# EAGLE design LD1-001 (EAGLE 7.1.0)
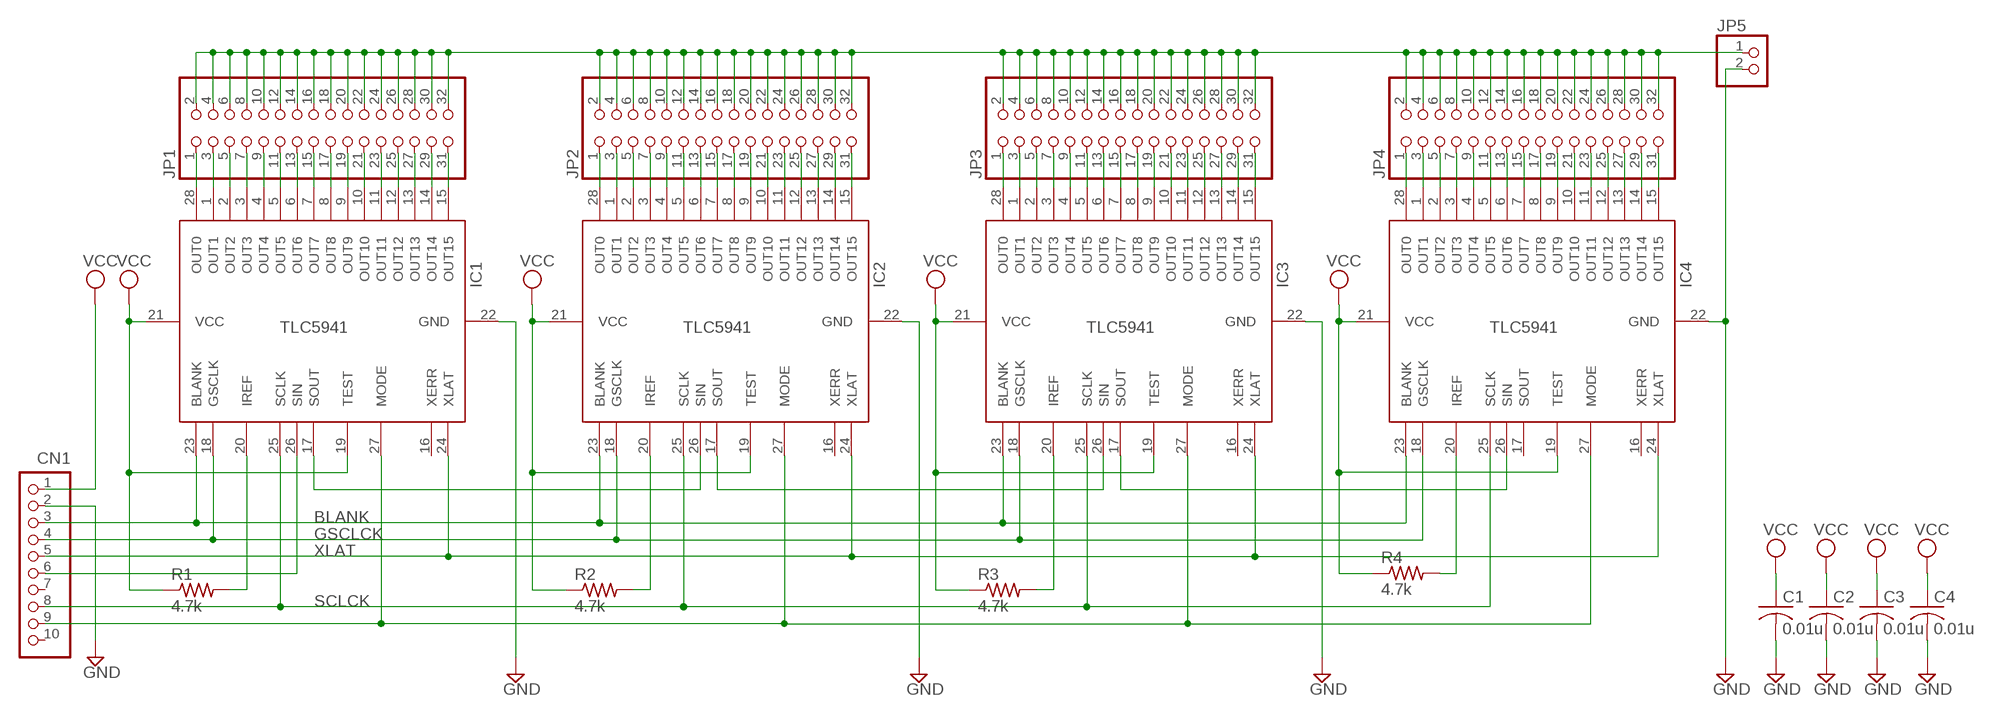
[diagram p0: schematic, sheet 1]

## Parts
C1  0.01u  C-US025-025X050  [C025-025X050]
C2  0.01u  C-US025-025X050  [C025-025X050]
C3  0.01u  C-US025-025X050  [C025-025X050]
C4  0.01u  C-US025-025X050  [C025-025X050]
CN1  S10B-PH-K-S  [S10B-PH-K-S]
IC1  TLC5941NT  [DIL28-3]
IC2  TLC5941NT  [DIL28-3]
IC3  TLC5941NT  [DIL28-3]
IC4  TLC5941NT  [DIL28-3]
JP1  PINHD-2X16  [2X16]
JP2  PINHD-2X16  [2X16]
JP3  PINHD-2X16  [2X16]
JP4  PINHD-2X16  [2X16]
JP5  PINHD-1X2  [1X02]
R1  4.7k  R-US_0204/5  [0204/5]
R2  4.7k  R-US_0204/5  [0204/5]
R3  4.7k  R-US_0204/5  [0204/5]
R4  4.7k  R-US_0204/5  [0204/5]

## Nets
BLANK: CN1.3 IC1.23(BLANK) IC2.23(BLANK) IC3.23(BLANK) IC4.23(BLANK)
GND: C1.2 C2.2 C3.2 C4.2 CN1.2 IC1.22(GND) IC2.22(GND) IC3.22(GND) IC4.22(GND) JP5.2
GSCLCK: CN1.4 IC1.18(GSCLK) IC2.18(GSCLK) IC3.18(GSCLK) IC4.18(GSCLK)
N$1: CN1.6 IC1.26(SIN)
N$2: IC1.17(SOUT) IC2.26(SIN)
N$3: IC2.17(SOUT) IC3.26(SIN)
N$4: IC3.17(SOUT) IC4.26(SIN)
N$5: IC1.28(OUT0) JP1.1
N$6: IC1.1(OUT1) JP1.3
N$7: IC1.2(OUT2) JP1.5
N$8: IC1.3(OUT3) JP1.7
N$9: IC1.4(OUT4) JP1.9
N$10: IC1.5(OUT5) JP1.11
N$11: IC1.6(OUT6) JP1.13
N$12: IC1.7(OUT7) JP1.15
N$13: IC1.8(OUT8) JP1.17
N$14: IC1.9(OUT9) JP1.19
N$15: IC1.10(OUT10) JP1.21
N$16: IC1.11(OUT11) JP1.23
N$17: IC1.12(OUT12) JP1.25
N$18: IC1.13(OUT13) JP1.27
N$19: IC1.14(OUT14) JP1.29
N$20: IC1.15(OUT15) JP1.31
N$21: IC2.28(OUT0) JP2.1
N$22: IC2.1(OUT1) JP2.3
N$23: IC2.2(OUT2) JP2.5
N$24: IC2.3(OUT3) JP2.7
N$25: IC2.4(OUT4) JP2.9
N$26: IC2.5(OUT5) JP2.11
N$27: IC2.6(OUT6) JP2.13
N$28: IC2.7(OUT7) JP2.15
N$29: IC2.8(OUT8) JP2.17
N$30: IC2.9(OUT9) JP2.19
N$31: IC2.10(OUT10) JP2.21
N$32: IC2.11(OUT11) JP2.23
N$33: IC2.12(OUT12) JP2.25
N$34: IC2.13(OUT13) JP2.27
N$35: IC2.14(OUT14) JP2.29
N$36: IC2.15(OUT15) JP2.31
N$37: IC4.20(IREF) R4.2
N$38: IC3.28(OUT0) JP3.1
N$39: IC3.1(OUT1) JP3.3
N$40: IC3.2(OUT2) JP3.5
N$41: IC3.3(OUT3) JP3.7
N$42: IC3.4(OUT4) JP3.9
N$43: IC3.5(OUT5) JP3.11
N$44: IC3.6(OUT6) JP3.13
N$45: IC3.7(OUT7) JP3.15
N$46: IC2.20(IREF) R2.2
N$47: IC3.20(IREF) R3.2
N$48: IC3.8(OUT8) JP3.17
N$49: IC3.9(OUT9) JP3.19
N$50: IC3.10(OUT10) JP3.21
N$51: IC3.11(OUT11) JP3.23
N$52: IC3.12(OUT12) JP3.25
N$53: IC3.13(OUT13) JP3.27
N$54: IC3.14(OUT14) JP3.29
N$55: IC3.15(OUT15) JP3.31
N$56: IC4.28(OUT0) JP4.1
N$57: IC4.1(OUT1) JP4.3
N$58: IC4.2(OUT2) JP4.5
N$59: IC4.3(OUT3) JP4.7
N$60: IC4.4(OUT4) JP4.9
N$61: IC4.5(OUT5) JP4.11
N$62: IC4.6(OUT6) JP4.13
N$63: IC4.7(OUT7) JP4.15
N$64: IC4.8(OUT8) JP4.17
N$65: IC1.20(IREF) R1.2
N$66: IC4.9(OUT9) JP4.19
N$67: IC4.10(OUT10) JP4.21
N$68: IC4.11(OUT11) JP4.23
N$69: IC4.12(OUT12) JP4.25
N$70: IC4.13(OUT13) JP4.27
N$71: IC4.14(OUT14) JP4.29
N$72: IC4.15(OUT15) JP4.31
N$73: JP1.2 JP1.4 JP1.6 JP1.8 JP1.10 JP1.12 JP1.14 JP1.16 JP1.18 JP1.20 JP1.22 JP1.24 JP1.26 JP1.28 JP1.30 JP1.32 JP2.2 JP2.4 JP2.6 JP2.8 JP2.10 JP2.12 JP2.14 JP2.16 JP2.18 JP2.20 JP2.22 JP2.24 JP2.26 JP2.28 JP2.30 JP2.32 JP3.2 JP3.4 JP3.6 JP3.8 JP3.10 JP3.12 JP3.14 JP3.16 JP3.18 JP3.20 JP3.22 JP3.24 JP3.26 JP3.28 JP3.30 JP3.32 JP4.2 JP4.4 JP4.6 JP4.8 JP4.10 JP4.12 JP4.14 JP4.16 JP4.18 JP4.20 JP4.22 JP4.24 JP4.26 JP4.28 JP4.30 JP4.32 JP5.1
N$75: CN1.9 IC1.27(MODE) IC2.27(MODE) IC3.27(MODE) IC4.27(MODE)
SCLCK: CN1.8 IC1.25(SCLK) IC2.25(SCLK) IC3.25(SCLK) IC4.25(SCLK)
VCC: C1.1 C2.1 C3.1 C4.1 CN1.1 IC1.19(TEST) IC1.21(VCC) IC2.19(TEST) IC2.21(VCC) IC3.19(TEST) IC3.21(VCC) IC4.19(TEST) IC4.21(VCC) R1.1 R2.1 R3.1 R4.1
XLAT: CN1.5 IC1.24(XLAT) IC2.24(XLAT) IC3.24(XLAT) IC4.24(XLAT)
Unconnected: CN1.7 CN1.10 IC1.16(XERR) IC2.16(XERR) IC3.16(XERR) IC4.16(XERR) IC4.17(SOUT)

## Library data of the parts
C1-C4 = rcl:C-US: CAPACITOR, American symbol
CN1 = jst-ph:S10B-PH-*: Wire-to-Board 2.0mm pitch side mount connector Source: http://www.jst-mfg.com/product/pdf/jpn/PH.pdf http://www.jst-mfg.com/product/detail.php?series=199
IC1-IC4 = adafruit:TLC5941
JP1-JP4 = pinhead:PINHD-2X16: PIN HEADER
JP5 = pinhead:PINHD-1X2: PIN HEADER
R1-R4 = resistor:R-US_: RESISTOR, American symbol

## Board
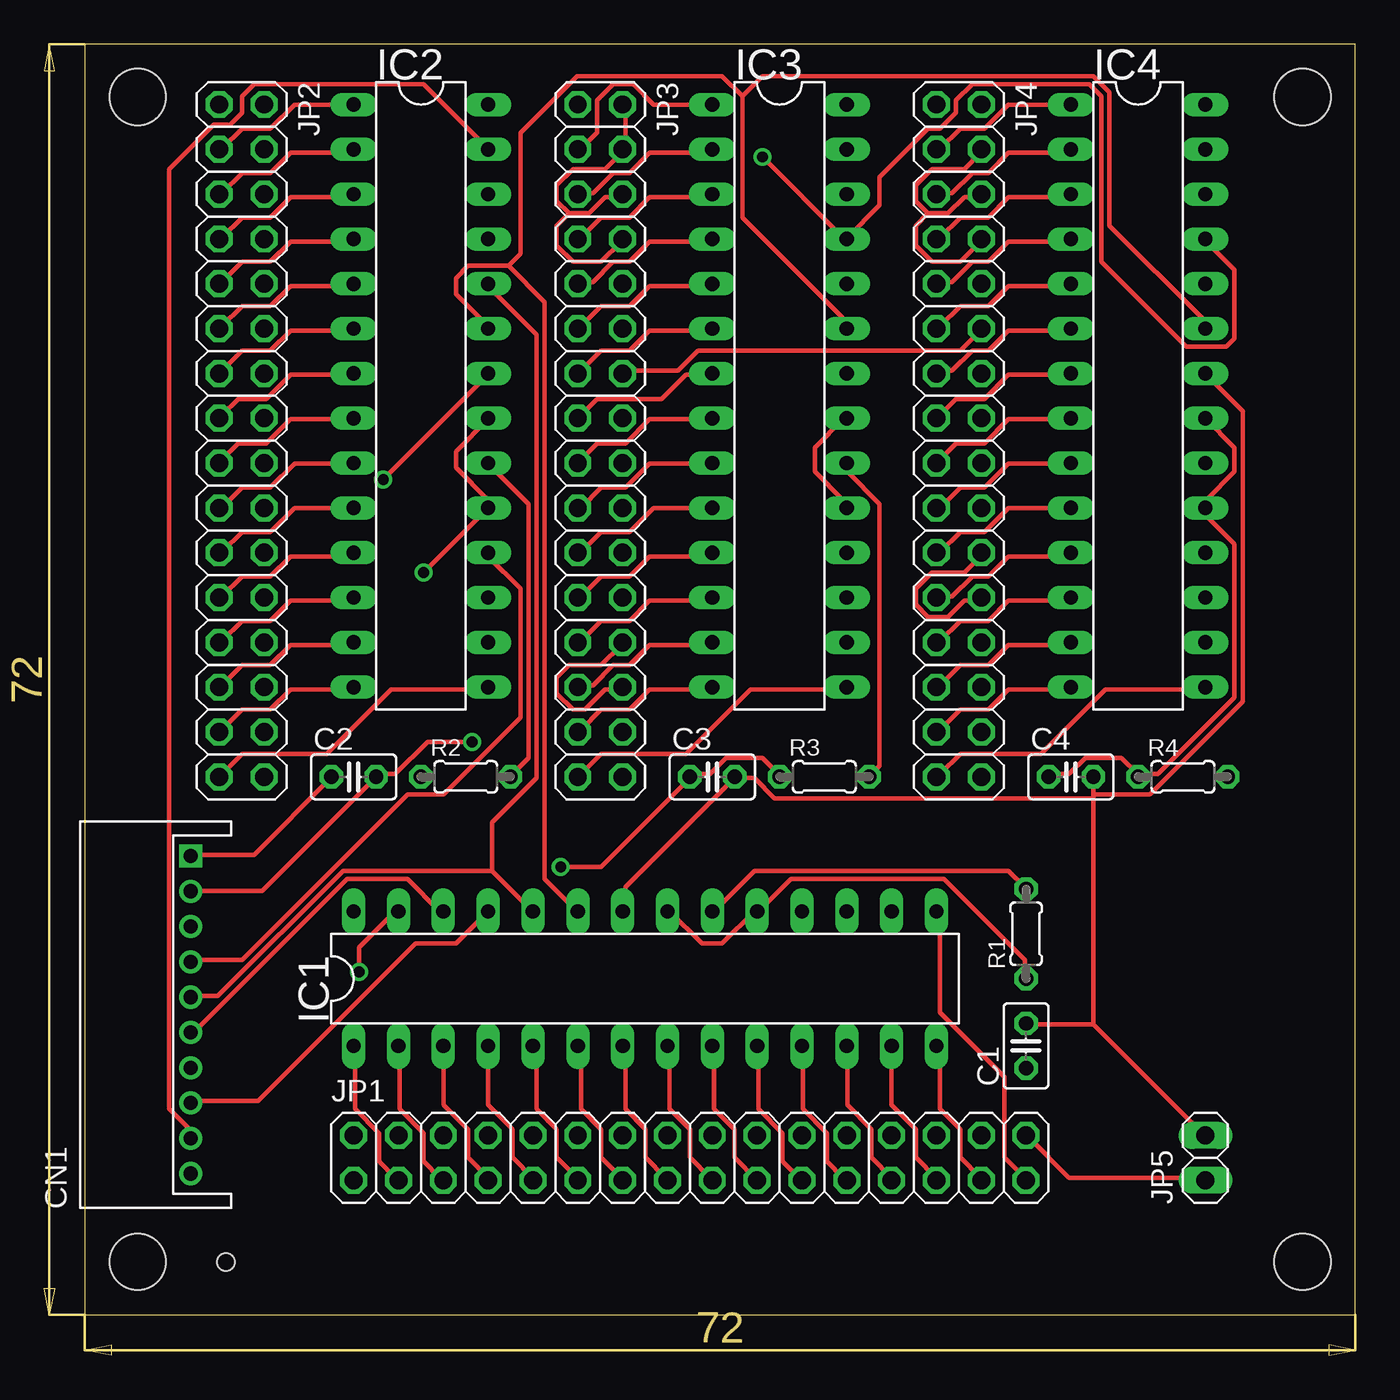
[diagram p1: board, top side]
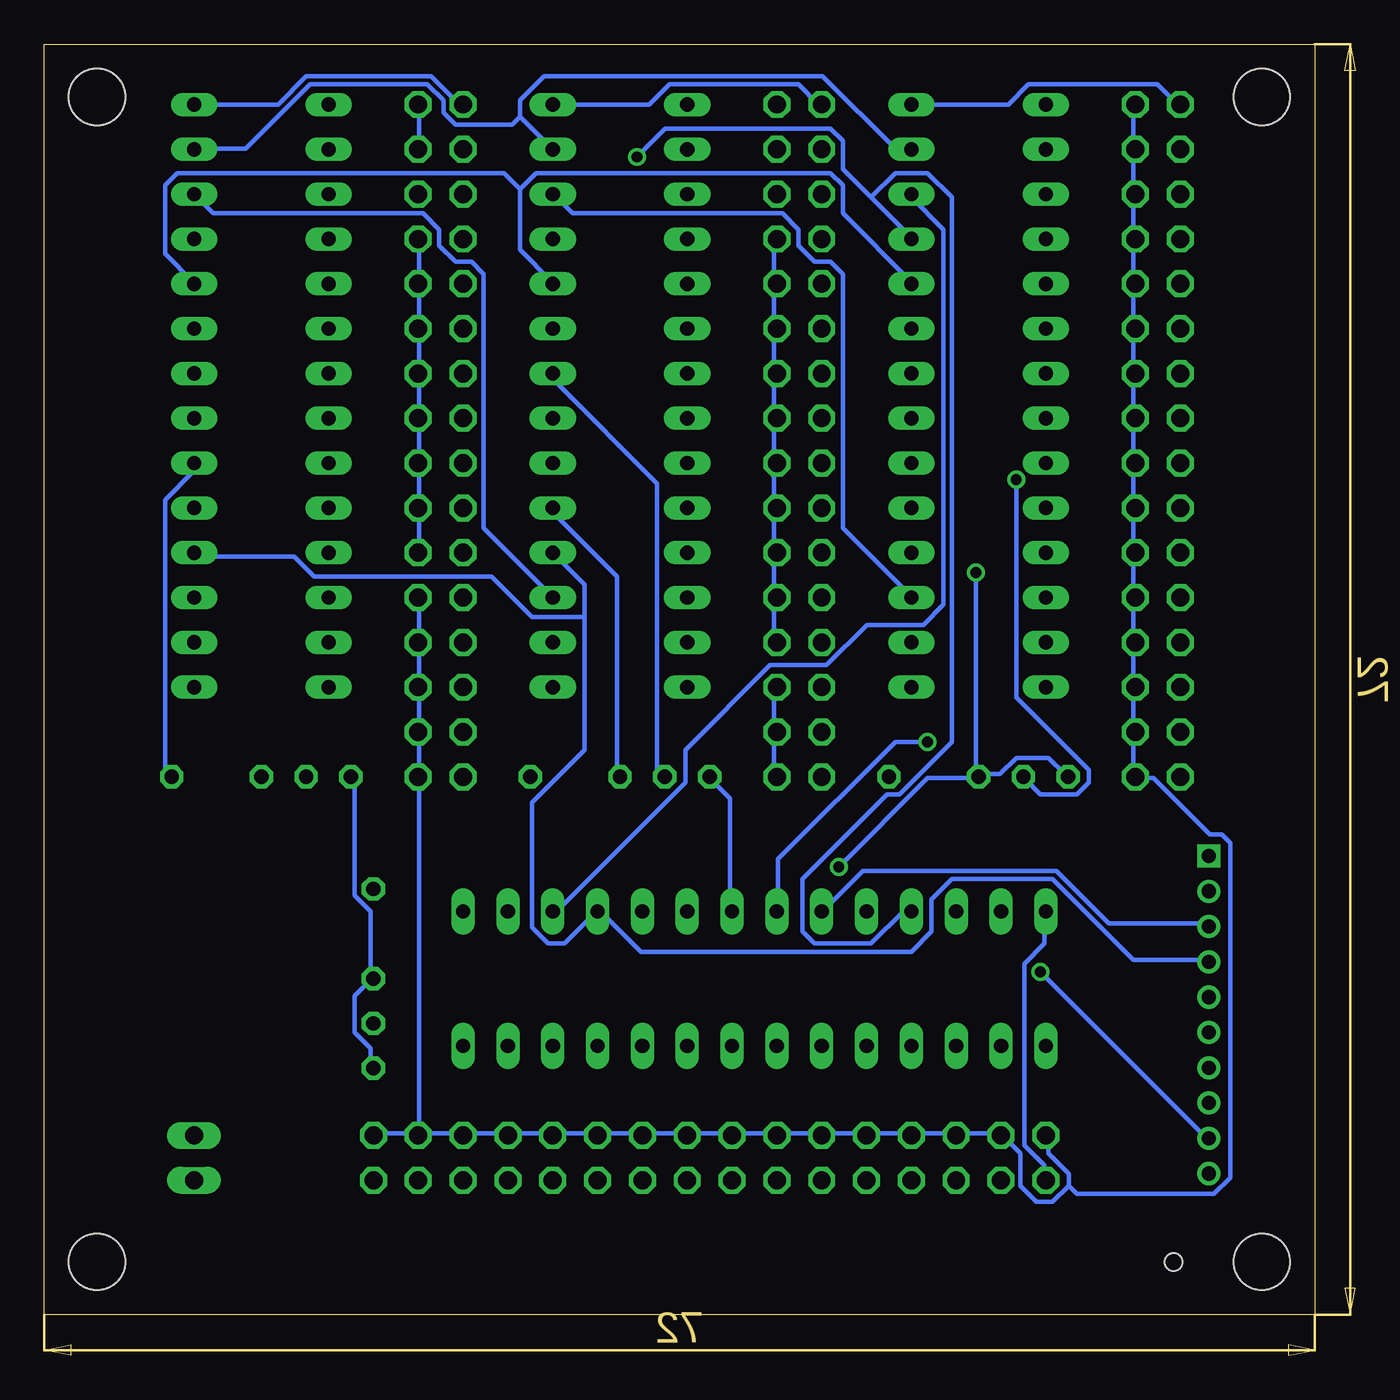
[diagram p2: board, bottom side, seen from below]

Size 72 x 72 mm. Coordinates in mm from the lower left corner, seen from the top.
Outline: 0,0 72,0 72,72 0,72 0,0
Copper layers (1*16): Top 0.035mm / dielectric 1.5mm / Bottom 0.035mm
Design rules "default": minimum track width 10mil, minimum drill 24mil, track to track 8mil, track to pad 8mil, pad to pad 8mil, via to via 8mil, smd to smd 8mil, copper to edge 40mil, drill to drill 8mil, minimum pad ring 10mil, minimum via ring 8mil, stop-mask expansion 4mil, vias tented up to drill 0mil, thermal gap 10mil
Holes 3.2 mm at 3,3 3,69 69,69 69,3
Holes 1 mm at 8,3

### Footprints (pad centres in the part's own frame; a part is rotated, then mirrored left to right if it is on the bottom)
C025-025X050 = drill 0.813 octagon: 1 -1.27,0; 2 1.27,0
S10B-PH-K-S = drill 0.8 square: 1 9,0 | drill 0.8: 2 7,0; 3 5,0; 4 3,0; 5 1,0; 6 -1,0; 7 -3,0; 8 -5,0; 9 -7,0; 10 -9,0
DIL28-3 = drill 0.813 long: 1 -16.51,-3.81; 2 -13.97,-3.81; 3 -11.43,-3.81; 4 -8.89,-3.81; 5 -6.35,-3.81; 6 -3.81,-3.81; 7 -1.27,-3.81; 8 1.27,-3.81; 9 3.81,-3.81; 10 6.35,-3.81; 11 8.89,-3.81; 12 11.43,-3.81; 13 13.97,-3.81; 14 16.51,-3.81; 15 16.51,3.81; 16 13.97,3.81; 17 11.43,3.81; 18 8.89,3.81; 19 6.35,3.81; 20 3.81,3.81; 21 1.27,3.81; 22 -1.27,3.81; 23 -3.81,3.81; 24 -6.35,3.81; 25 -8.89,3.81; 26 -11.43,3.81; 27 -13.97,3.81; 28 -16.51,3.81
2X16 = drill 1.016 octagon: 1 -19.05,-1.27; 2 -19.05,1.27; 3 -16.51,-1.27; 4 -16.51,1.27; 5 -13.97,-1.27; 6 -13.97,1.27; 7 -11.43,-1.27; 8 -11.43,1.27; 9 -8.89,-1.27; 10 -8.89,1.27; 11 -6.35,-1.27; 12 -6.35,1.27; 13 -3.81,-1.27; 14 -3.81,1.27; 15 -1.27,-1.27; 16 -1.27,1.27; 17 1.27,-1.27; 18 1.27,1.27; 19 3.81,-1.27; 20 3.81,1.27; 21 6.35,-1.27; 22 6.35,1.27; 23 8.89,-1.27; 24 8.89,1.27; 25 11.43,-1.27; 26 11.43,1.27; 27 13.97,-1.27; 28 13.97,1.27; 29 16.51,-1.27; 30 16.51,1.27; 31 19.05,-1.27; 32 19.05,1.27
1X02 = drill 1.016 long: 1 -1.27,0; 2 1.27,0
0204/5 = drill 0.813 octagon: 1 -2.54,0; 2 2.54,0

### Placement (x,y rotation side)
C1  53.34,15.24 90 top
C2  15.24,30.48 0 top
C3  35.56,30.48 0 top
C4  55.88,30.48 0 top
CN1  6,17 90 top
IC1  31.75,19.05 0 top
IC2  19.05,52.07 270 top
IC3  39.37,52.07 270 top
IC4  59.69,52.07 270 top
JP1  34.29,8.89 0 top
JP2  8.89,49.53 270 top
JP3  29.21,49.53 270 top
JP4  49.53,49.53 270 top
JP5  63.5,8.89 90 top
R1  53.34,21.59 90 top
R2  21.59,30.48 0 top
R3  41.91,30.48 0 top
R4  62.23,30.48 0 top

### Tracks (layer width: path | path; a pad name or v marks a point on that pad's centre or on a via)
BLANK
  Top 0.254: 24,59.44 21.72,59.44 21.03,58.75 21.03,57.84 22.86,56.01 IC2.23 | 24,59.44 26.06,57.38 26.06,24.69 27.89,22.86 IC1.23 | 37.26,69.04 37.26,62.18 42.98,56.46 42.98,56.01 IC3.23 | 37.26,69.04 36.12,70.18 27.89,70.18 24.69,66.98 24.69,60.12 24,59.44 | 37.26,69.04 38.41,70.18 57.15,70.18 58.06,69.27 58.06,61.72 63.32,56.46 63.32,56.01 IC4.23
  Bottom 0.254: CN1.3 6.17,22.17 11.66,22.17 14.63,25.15 25.6,25.15 27.89,22.86 IC1.23
GND  (via drill 0.61)
  Top 0.254: CN1.2 6.17,24 10.06,24 16.46,30.4 C2.2 16.69,30.63 17.6,30.63 19.43,32.46 v21.95,32.46 | v16.92,47.32 22.86,53.26 IC2.22 | IC1.22 30.63,22.86 30.63,24.23 36.8,30.4 C3.2 37.03,30.4 37.95,30.4 39.09,29.26 57.15,29.26 | 57.15,16.46 53.49,16.46 C1.2 | 57.15,16.46 63.32,10.29 JP5.2 | 57.15,16.46 57.15,29.26 | 57.15,29.26 57.15,29.49 | 57.15,29.49 C4.2 | 57.15,29.49 60.35,29.49 65.61,34.75 65.61,51.21 63.55,53.26 IC4.22
  Bottom 0.254: v16.92,47.32 16.92,34.98 12.8,30.86 12.8,30.18 13.49,29.49 15.54,29.49 16.46,30.4 C2.2 | IC3.22 42.98,53.26 42.98,52.81 37.26,47.09 37.26,30.86 37.03,30.63 C3.2 | v21.95,32.46 23.77,32.46 30.4,25.83 30.4,22.86 IC1.22
GSCLCK
  Top 0.254: CN1.4 6.17,20.12 8.91,20.12 18.29,29.49 20.34,29.49 24.69,33.83 24.69,41.15 22.86,42.98 IC2.18
  Bottom 0.254: 41.38,39.55 41.38,41.38 IC3.18 | 41.38,39.55 41.38,32 44.35,29.03 44.35,21.95 43.43,21.03 42.52,21.03 40.69,22.86 IC1.18 40.46,22.86 38.18,20.57 22.86,20.57 21.72,21.72 21.72,23.55 20.57,24.69 14.86,24.69 10.29,20.12 6.17,20.12 CN1.4 | 41.38,39.55 44.35,39.55 46.63,41.83 56.69,41.83 57.84,42.98 63.32,42.98 IC4.18
N$1
  Top 0.254: CN1.6 6.17,16 14.86,24.69 18.29,24.69 20.12,22.86 IC1.26
N$2
  Bottom 0.254: IC2.26 22.86,63.32 21.03,61.49 21.03,40.23 22.17,39.09 25.38,39.09 27.66,36.8 30.86,36.8 35.66,32 35.66,30.18 42.98,22.86 IC1.17
N$3
  Bottom 0.254: IC2.17 22.86,40.69 26.75,44.58 26.75,58.98 27.43,59.66 28.35,59.66 29.26,60.58 29.26,61.49 30.18,62.41 42.06,62.41 42.98,63.32 IC3.26
N$4
  Bottom 0.254: IC4.26 62.41,62.41 50.52,62.41 49.61,61.49 49.61,60.58 48.69,59.66 47.78,59.66 47.09,58.98 47.09,44.58 43.2,40.69 IC3.17
N$5
  Bottom 0.254: IC1.28 15.32,22.86 15.32,21.03 16.46,19.89 16.46,9.6 15.32,8.46 15.32,7.77 JP1.1
N$6
  Top 0.254: IC1.1 15.32,15.09 15.32,11.66 16.69,10.29 16.69,8.69 17.6,7.77 JP1.3
N$7
  Top 0.254: IC1.2 17.83,15.09 17.83,11.66 19.2,10.29 19.2,8.69 20.12,7.77 JP1.5
N$8
  Top 0.254: IC1.3 20.34,15.09 20.34,11.89 21.72,10.52 21.72,8.91 22.86,7.77 JP1.7
N$9
  Top 0.254: IC1.4 22.86,11.89 24.23,10.52 24.23,8.91 25.38,7.77 JP1.9
N$10
  Top 0.254: IC1.5 25.6,15.09 25.6,11.66 26.75,10.52 26.75,8.91 27.89,7.77 JP1.11
N$11
  Top 0.254: IC1.6 28.12,15.09 28.12,11.66 29.26,10.52 29.26,8.91 30.4,7.77 JP1.13
N$12
  Top 0.254: IC1.7 30.63,15.09 30.63,11.66 31.77,10.52 31.77,8.91 32.92,7.77 JP1.15
N$13
  Top 0.254: IC1.8 33.15,15.09 33.15,11.66 34.29,10.52 34.29,8.91 35.43,7.77 JP1.17
N$14
  Top 0.254: JP1.19 36.8,8.91 36.8,10.52 35.66,11.66 35.66,15.09 IC1.9
N$15
  Top 0.254: IC1.10 38.18,15.09 38.18,11.66 39.55,10.29 39.55,8.69 40.46,7.77 JP1.21
N$16
  Top 0.254: IC1.11 40.69,15.09 40.69,11.66 42.06,10.29 42.06,8.69 42.98,7.77 JP1.23
N$17
  Top 0.254: IC1.12 43.2,15.09 43.2,11.89 44.58,10.52 44.58,8.91 45.72,7.77 JP1.25
N$18
  Top 0.254: IC1.13 45.72,11.89 47.09,10.52 47.09,8.91 48.23,7.77 JP1.27
N$19
  Top 0.254: IC1.14 48.46,15.09 48.46,11.66 49.61,10.52 49.61,8.91 50.75,7.77 JP1.29
N$20
  Top 0.254: IC1.15 48.46,22.86 48.46,17.14 52.12,13.49 52.12,8.91 53.26,7.77 JP1.31
N$21
  Bottom 0.254: IC2.28 17.37,68.58 16.23,69.72 8.91,69.72 7.77,68.58 JP2.1
N$22
  Top 0.254: IC2.1 11.89,68.58 10.52,67.21 8.91,67.21 7.77,66.06 JP2.3
N$23
  Top 0.254: IC2.2 15.09,65.84 11.66,65.84 10.52,64.69 8.91,64.69 7.77,63.55 JP2.5
N$24
  Top 0.254: IC2.3 15.09,63.32 11.66,63.32 10.52,62.18 8.91,62.18 7.77,61.04 JP2.7
N$25
  Top 0.254: IC2.4 15.09,60.81 11.66,60.81 10.52,59.66 8.91,59.66 7.77,58.52 JP2.9
N$26
  Top 0.254: IC2.5 15.09,58.29 11.66,58.29 10.52,57.15 8.91,57.15 7.77,56.01 JP2.11
N$27
  Top 0.254: JP2.13 8.91,54.63 10.52,54.63 11.66,55.78 15.09,55.78 IC2.6
N$28
  Top 0.254: IC2.7 15.09,53.26 11.66,53.26 10.29,51.89 8.69,51.89 7.77,50.98 JP2.15
N$29
  Top 0.254: IC2.8 15.09,50.75 11.66,50.75 10.29,49.38 8.69,49.38 7.77,48.46 JP2.17
N$30
  Top 0.254: IC2.9 15.09,48.23 11.89,48.23 10.52,46.86 8.91,46.86 7.77,45.72 JP2.19
N$31
  Top 0.254: IC2.10 11.89,45.72 10.52,44.35 8.91,44.35 7.77,43.2 JP2.21
N$32
  Top 0.254: IC2.11 15.09,42.98 11.66,42.98 10.52,41.83 8.91,41.83 7.77,40.69 JP2.23
N$33
  Top 0.254: IC2.12 15.09,40.46 11.66,40.46 10.52,39.32 8.91,39.32 7.77,38.18 JP2.25
N$34
  Top 0.254: IC2.13 15.09,37.95 11.66,37.95 10.52,36.8 8.91,36.8 7.77,35.66 JP2.27
N$35
  Top 0.254: IC2.14 15.09,35.43 11.66,35.43 10.52,34.29 8.91,34.29 7.77,33.15 JP2.29
N$36
  Top 0.254: JP2.31 8.91,31.77 13.72,31.77 17.37,35.43 22.86,35.43 IC2.15
N$37
  Bottom 0.254: R4.2 65.15,30.86 65.15,46.18 63.55,47.78 63.55,48.23 IC4.20
N$38
  Bottom 0.254: IC3.28 37.72,68.58 36.58,69.72 29.26,69.72 28.12,68.58 JP3.1
N$39
  Top 0.254: IC3.1 32.23,68.58 31.09,69.72 29.95,69.72 29.03,68.81 29.03,66.98 28.12,66.06 JP3.3
N$40
  Top 0.254: IC3.2 35.43,65.84 32,65.84 30.86,64.69 29.95,64.69 28.8,63.55 28.12,63.55 JP3.5
N$41
  Top 0.254: IC3.3 35.43,63.32 32,63.32 30.86,62.18 29.26,62.18 28.12,61.04 JP3.7
N$42
  Top 0.254: IC3.4 35.43,60.81 32,60.81 30.86,59.66 29.95,59.66 28.8,58.52 28.12,58.52 JP3.9
N$43
  Top 0.254: IC3.5 35.43,58.29 32,58.29 30.86,57.15 29.26,57.15 28.12,56.01 JP3.11
N$44
  Top 0.254: IC3.6 35.43,55.78 32,55.78 30.86,54.63 29.26,54.63 28.12,53.49 JP3.13
N$45
  Top 0.254: JP3.15 29.03,51.89 32.69,51.89 34.06,53.26 35.43,53.26 IC3.7
N$46
  Top 0.254: IC2.20 22.86,48.23 25.15,45.95 25.15,31.55 24.23,30.63 R2.2
N$47
  Top 0.254: IC3.20 43.2,48.23 43.2,47.78 45.03,45.95 45.03,31.09 44.58,30.63 R3.2
N$48
  Top 0.254: IC3.8 35.43,50.75 32,50.75 30.63,49.38 29.03,49.38 28.12,48.46 JP3.17
N$49
  Top 0.254: IC3.9 35.43,48.23 32,48.23 30.63,46.86 29.26,46.86 28.12,45.72 JP3.19
N$50
  Top 0.254: IC3.10 32.23,45.72 30.86,44.35 29.26,44.35 28.12,43.2 JP3.21
N$51
  Top 0.254: IC3.11 35.43,42.98 32,42.98 30.86,41.83 29.26,41.83 28.12,40.69 JP3.23
N$52
  Top 0.254: IC3.12 35.43,40.46 32,40.46 30.86,39.32 29.26,39.32 28.12,38.18 JP3.25
N$53
  Top 0.254: IC3.13 35.43,37.95 32,37.95 30.86,36.8 29.95,36.8 28.8,35.66 28.12,35.66 JP3.27
N$54
  Top 0.254: IC3.14 35.43,35.43 32,35.43 30.86,34.29 29.26,34.29 28.12,33.15 JP3.29
N$55
  Top 0.254: IC3.15 42.98,35.43 37.72,35.43 34.06,31.77 29.26,31.77 28.12,30.63 JP3.31
N$56
  Bottom 0.254: IC4.28 58.75,68.58 57.15,70.18 50.06,70.18 48.46,68.58 JP4.1
N$57
  Top 0.254: IC4.1 52.35,68.58 50.98,67.21 49.61,67.21 48.46,66.06 JP4.3
N$58
  Top 0.254: IC4.2 55.78,65.84 52.35,65.84 51.21,64.69 50.29,64.69 49.15,63.55 48.46,63.55 JP4.5
N$59
  Top 0.254: IC4.3 55.78,63.32 52.35,63.32 51.21,62.18 49.61,62.18 48.46,61.04 JP4.7
N$60
  Top 0.254: IC4.4 55.78,60.81 52.35,60.81 51.21,59.66 50.29,59.66 49.15,58.52 48.46,58.52 JP4.9
N$61
  Top 0.254: IC4.5 55.78,58.29 52.35,58.29 51.21,57.15 49.61,57.15 48.46,56.01 JP4.11
N$62
  Top 0.254: IC4.6 55.78,55.78 52.35,55.78 51.21,54.63 50.29,54.63 49.15,53.49 48.46,53.49 JP4.13
N$63
  Top 0.254: IC4.7 55.78,53.26 52.35,53.26 50.98,51.89 49.38,51.89 48.46,50.98 JP4.15
N$64
  Top 0.254: JP4.17 49.38,49.38 50.98,49.38 52.35,50.75 55.78,50.75 IC4.8
N$65
  Top 0.254: IC1.20 35.66,22.86 37.95,25.15 52.35,25.15 53.26,24.23 R1.2
N$66
  Top 0.254: IC4.9 55.78,48.23 52.35,48.23 50.98,46.86 49.61,46.86 48.46,45.72 JP4.19
N$67
  Top 0.254: IC4.10 52.35,45.72 50.98,44.35 49.61,44.35 48.46,43.2 JP4.21
N$68
  Top 0.254: IC4.11 55.78,42.98 52.35,42.98 51.21,41.83 50.29,41.83 49.15,40.69 48.46,40.69 JP4.23
N$69
  Top 0.254: IC4.12 55.78,40.46 52.35,40.46 51.21,39.32 49.61,39.32 48.46,38.18 JP4.25
N$70
  Top 0.254: IC4.13 55.78,37.95 52.35,37.95 51.21,36.8 49.61,36.8 48.46,35.66 JP4.27
N$71
  Top 0.254: IC4.14 55.78,35.43 52.35,35.43 51.21,34.29 49.61,34.29 48.46,33.15 JP4.29
N$72
  Top 0.254: IC4.15 63.32,35.43 57.84,35.43 54.18,31.77 49.61,31.77 48.46,30.63 JP4.31
N$73
  Top 0.254: JP3.28 30.4,35.43 29.49,35.43 28.35,34.29 27.66,34.29 26.75,35.2 26.75,36.12 27.43,36.8 29.26,36.8 30.4,37.95 JP3.26 | 27.43,62.41 28.57,62.41 29.49,63.32 30.4,63.32 JP3.6 | 27.43,62.41 26.75,63.09 26.75,64.01 27.66,64.92 29.49,64.92 30.4,65.84 JP3.4 30.63,66.06 30.63,68.58 JP3.2 | 27.43,62.41 26.75,61.72 26.75,60.58 27.66,59.66 29.26,59.66 30.4,60.81 JP3.8 | 47.78,62.41 48.92,62.41 49.84,63.32 50.75,63.32 JP4.6 | 47.78,62.41 47.09,63.09 47.09,64.01 48.01,64.92 49.84,64.92 50.75,65.84 JP4.4 | 47.78,62.41 47.09,61.72 47.09,60.58 48.01,59.66 49.61,59.66 50.75,60.81 JP4.8 | JP4.24 50.75,40.46 49.84,40.46 48.92,39.55 47.78,39.55 47.09,40.23 47.09,41.15 48.01,42.06 49.84,42.06 50.75,42.98 JP4.22 | JP5.1 63.32,7.77 55.78,7.77 53.49,10.06 JP1.32 | JP3.14 30.63,53.49 33.6,53.49 34.75,54.63 49.61,54.63 50.75,55.78 JP4.12
  Bottom 0.254: JP3.32 30.63,30.63 30.63,32.92 JP3.30 30.63,33.15 30.63,35.43 JP3.28 | JP3.26 30.63,38.18 30.63,40.46 JP3.24 30.63,40.69 30.63,42.98 JP3.22 30.63,43.2 30.63,45.72 | JP3.8 30.63,60.81 30.63,58.52 JP3.10 30.63,58.29 30.63,56.01 JP3.12 30.63,55.78 30.63,53.49 JP3.14 30.63,53.26 30.63,50.98 JP3.16 30.63,50.75 30.63,48.46 JP3.18 30.63,48.23 30.63,45.72 | 30.63,45.72 JP3.20 | JP4.24 50.75,40.46 50.75,38.18 JP4.26 50.75,37.95 50.75,35.66 JP4.28 50.75,35.43 50.75,33.15 JP4.30 50.75,32.92 50.75,30.63 JP4.32 50.75,30.4 50.75,10.29 | JP4.2 50.75,68.58 50.75,66.06 JP4.4 | JP4.8 50.75,60.81 50.75,58.52 JP4.10 50.75,58.29 50.75,56.01 JP4.12 50.75,55.78 50.75,53.49 JP4.14 50.75,53.26 50.75,50.98 JP4.16 50.75,50.75 50.75,48.46 JP4.18 50.75,48.23 50.75,45.72 | 50.75,45.72 50.75,43.2 JP4.22 | 50.75,45.72 JP4.20 | JP2.2 10.29,68.58 10.29,66.06 JP2.4 10.29,65.84 10.29,63.55 JP2.6 10.29,63.32 10.29,61.04 JP2.8 10.29,60.81 10.29,58.52 JP2.10 10.29,58.29 10.29,56.01 JP2.12 10.29,55.78 10.29,53.49 JP2.14 10.29,53.26 10.29,50.98 JP2.16 10.29,50.75 10.29,48.46 JP2.18 10.29,48.23 10.29,45.72 | 10.29,45.72 10.29,43.2 JP2.22 10.29,42.98 10.29,40.69 JP2.24 10.29,40.46 10.29,38.18 JP2.26 10.29,37.95 10.29,35.66 JP2.28 10.29,35.43 10.29,33.15 JP2.30 10.29,32.92 10.29,30.63 JP2.32 10.06,30.4 9.14,30.4 5.94,27.2 5.26,27.2 4.8,26.75 4.8,7.77 5.71,6.86 13.49,6.86 13.95,7.32 | 10.29,45.72 JP2.20 | 50.75,10.29 48.46,10.29 JP1.28 48.23,10.29 45.72,10.29 | JP1.32 53.26,10.29 50.98,10.29 JP1.30 50.75,10.29 | 13.95,7.32 13.95,8 15.09,9.14 15.09,10.06 JP1.2 | 13.95,7.32 14.86,6.4 15.77,6.4 16.69,7.32 16.69,9.14 17.6,10.06 JP1.4 17.83,10.29 20.12,10.29 JP1.6 20.34,10.29 22.86,10.29
  Bottom 0.254: 45.72,10.29 43.2,10.29 JP1.24 42.98,10.29 40.69,10.29 JP1.22 40.46,10.29 38.18,10.29 JP1.20 37.95,10.29 35.66,10.29 JP1.18 35.43,10.29 33.15,10.29 JP1.16 32.92,10.29 30.63,10.29 JP1.14 30.4,10.29 28.12,10.29 JP1.12 27.89,10.29 25.6,10.29 JP1.10 25.38,10.29 22.86,10.29 | 22.86,10.29 JP1.8 | 45.72,10.29 JP1.26
N$75  (via drill 0.61)
  Top 0.254: v15.54,19.43 15.54,20.8 17.6,22.86 IC1.27 | CN1.9 5.94,10.06 5.94,10.52 4.8,11.66 4.8,64.92 7.32,67.44 8.23,67.44 8.91,68.12 8.91,69.04 9.6,69.72 19.2,69.72 22.86,66.06 IC2.27
  Bottom 0.254: v15.54,19.43 6.17,10.06 CN1.9 | 45.03,67.89 45.03,68.81 43.66,70.18 27.89,70.18 23.77,66.06 22.86,66.06 IC2.27 | IC3.27 45.03,67.89 | 45.03,67.89 45.49,67.44 48.69,67.44 49.38,68.12 49.38,68.81 50.29,69.72 56.92,69.72 60.58,66.06 63.32,66.06 IC4.27
SCLCK  (via drill 0.61)
  Top 0.254: IC1.25 21.03,21.03 18.75,21.03 9.83,12.12 6.17,12.12 CN1.8 | v38.41,65.61 42.98,61.04 IC3.25 43.2,61.04 45.03,62.87 45.03,64.47 47.78,67.21 48.46,67.21 49.38,68.12 49.38,68.81 50.29,69.72 56.92,69.72 57.61,69.04 57.61,59.66 62.41,54.86 64.69,54.86 65.15,55.32 65.15,59.21 63.55,60.81 IC4.25
  Bottom 0.254: 25.15,63.32 26.75,64.92 26.75,66.52 27.43,67.21 36.8,67.21 v38.41,65.61 | 25.15,63.32 22.86,61.04 IC2.25 | IC1.25 23.32,22.86 25.15,21.03 28.35,21.03 29.03,21.72 29.03,24.69 24.23,29.49 23.55,29.49 20.57,32.46 20.57,63.32 21.95,64.69 23.77,64.69 25.15,63.32
VCC  (via drill 0.61)
  Top 0.254: IC2.21 22.86,50.75 21.03,48.92 21.03,48.01 22.86,46.18 IC2.19 v19.2,42.06 | CN1.1 6.17,26.06 9.6,26.06 13.95,30.4 C2.1 | IC3.19 42.98,45.72 42.98,46.18 41.38,47.78 41.38,49.15 42.98,50.75 IC3.21 | IC1.21 33.15,22.86 34.98,21.03 36.12,21.03 37.95,22.86 IC1.19 38.18,22.86 40.01,24.69 48.69,24.69 53.26,20.12 53.26,19.2 R1.1 | R3.1 39.32,30.63 38.41,31.55 36.35,31.55 35.43,30.63 34.29,30.63 C3.1 34.29,30.4 29.26,25.38 v26.98,25.38 | 63.55,45.72 63.55,46.18 65.15,47.78 65.15,49.15 IC4.21 | C4.1 54.63,30.63 55.78,30.63 56.69,31.55 58.75,31.55 59.66,30.63 R4.1 59.89,30.63 60.81,30.63 65.15,34.98 65.15,43.66 63.55,45.26 63.55,45.72 | 63.55,45.72 IC4.19
  Bottom 0.254: R2.1 18.97,30.63 17.83,30.63 16.92,31.55 15.09,31.55 14.17,30.63 C2.1 | v19.2,42.06 19.2,30.63 R2.1 | IC1.21 33.15,22.86 33.15,29.26 34.29,30.4 C3.1 | IC3.19 42.98,45.72 42.98,45.26 39.55,41.83 39.55,30.63 R3.1 | C1.1 53.49,14.17 53.49,15.09 54.41,16 54.41,18.06 53.49,18.97 R1.1 53.49,19.2 53.49,22.86 54.41,23.77 54.41,30.4 C4.1 | v26.98,25.38 21.95,30.4 19.2,30.4 R2.1
XLAT
  Top 0.254: 23.09,25.15 14.63,25.15 7.54,18.06 6.17,18.06 CN1.5 | 23.09,25.15 25.38,22.86 IC1.24 | 23.09,25.15 23.09,27.89 25.6,30.4 25.6,55.55 22.86,58.29 IC2.24
  Bottom 0.254: 45.03,63.78 44.12,64.69 27.43,64.69 26.75,64.01 26.75,62.41 22.86,58.52 IC2.24 | 45.03,63.78 45.03,60.35 43.2,58.52 IC3.24 | 45.03,63.78 45.95,64.69 64.47,64.69 65.15,64.01 65.15,60.12 63.55,58.52 IC4.24